# Altium schematic sheet Led_rgb.SchDoc
size A4; SheetNumber: 6
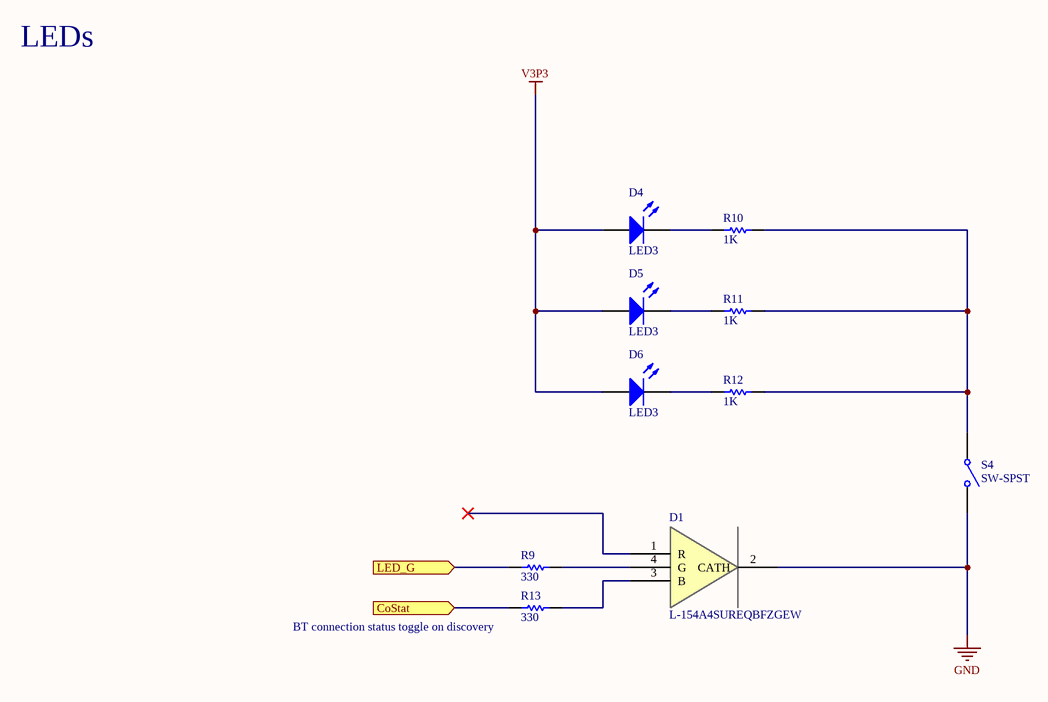
[diagram p0: Led_rgb.SchDoc]

## Parts
D1  L-154A4SUREQBFZGEW  [L-154A4SUREQBFZGEW]
D4  LED3  [LED2.5]
D5  LED3  [LED2.5]
D6  LED3  [LED2.5]
R9  330  [own_0603]
R10  1K  [own_0603]
R11  1K  [own_0603]
R12  1K  [own_0603]
R13  330  [own_0603]
S4  SW-SPST  [SPST-2]

## Ports
CoStat (in), LED_G (in)

## Nets
GND: D1.2(CATH) S4.2(NO)
V3P3: D4.1(A) D5.1(A) D6.1(A)
CoStat: R13.2 ; port CoStat
LED_G: R9.2 ; port LED_G
NetD1_3: D1.3(B) R13.1
NetD1_4: D1.4(G) R9.1
NetD4_2: D4.2(K) R10.1
NetD5_2: D5.2(K) R11.1
NetD6_2: D6.2(K) R12.1
NetR10_2: R10.2 R11.2 R12.2 S4.1(COMMON)

Not connected (* = marked no-connect by the designer): D1 1(R)*

## Notes on the sheet
- LEDs
- (near R13) BT connection status toggle on discovery

## Library data of the parts
D1 = L-154A4SUREQBFZGEW: LED RGB; Fabricant: Kingbright; Fournisseur: Farnell; RefFournisseur: 2290375; RefFabricant: L-154A4SUREQBFZGEW
D4-D6 = LED3: Typical BLUE SiC LED; Fabricant: MULTICOMP; RefFabricant: MCL034SWC-WH1; Fournisseur: Farnell; RefFournisseur: 1581176
R9-R13 = Res1: Resistor; Published: 8-Jun-2000; LatestRevisionDate: 17-Jul-2002; LatestRevisionNote: Re-released for DXP Platform.; PackageReference: AXIAL-0.3; Publisher: Altium Limited; PackageDescription: Axial Device, Thru-Hole; 2 Leads; 0.3 in Pin Spacing
  R9 R13: Value: 330
  R10-R12: Value: 1K
S4 = SW-SPST: Single-Pole, Single-Throw Switch